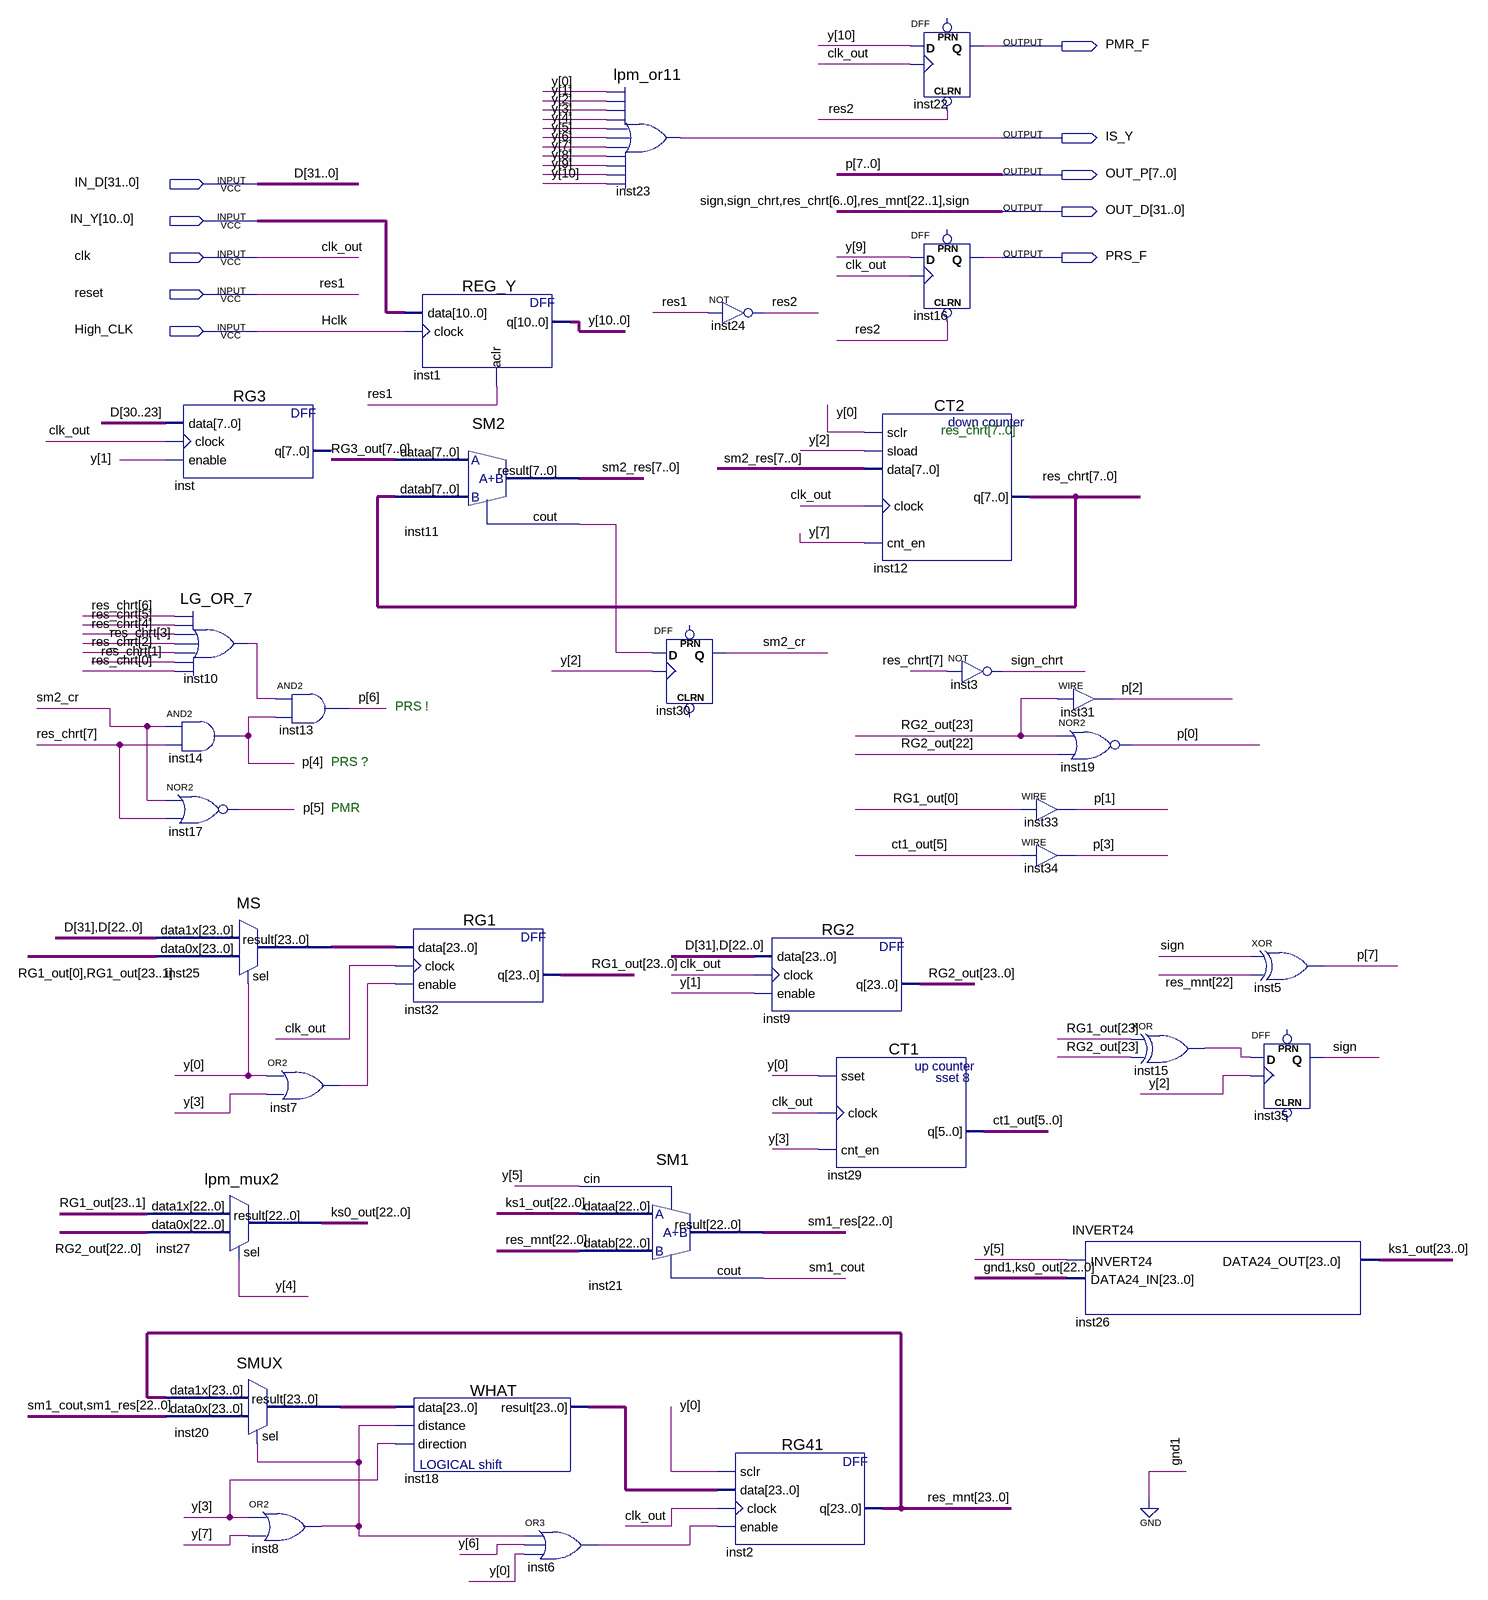
[diagram p0: schematic sheet]
// Quartus schematic Mult_DK_1.bdf as structural Verilog: 34 symbols, 10 pins
module Mult_DK_1 (
  input  [31:0] IN_D,
  input  [10:0] IN_Y,
  input  clk,
  input  reset,
  input  High_CLK,
  output PMR_F,
  output IS_Y,
  output [7:0] OUT_P,
  output [31:0] OUT_D,
  output PRS_F
);

  wire inst6_out, inst7_out, inst8_out, inst10_result, inst11_cout, inst15_out, res2, sm1_cout, sm2_cr;
  wire [5:0] ct1_out;
  wire [7:0] RG3_out, sm2_res;
  wire [7:7] res_chrt;
  wire [10:0] y;
  wire [22:0] ks0_out, sm1_res;
  wire [23:0] inst18_result, inst20_result, inst25_result, ks1_out, res_mnt, RG1_out, RG2_out;

  RG3 inst (.data(IN_D[30:23]), .clock(clk), .enable(y[1]));  // open: q
  LG_OR_7 inst10 (
    .data0(OUT_D[29]), .data1(OUT_D[28]), .data2(OUT_D[27]), .data3(OUT_D[26]), .data4(OUT_D[25]),
    .data5(OUT_D[24]), .data6(OUT_D[23]), .result(inst10_result));
  and inst14 (OUT_P[4], sm2_cr, res_chrt[7]);
  nor inst17 (OUT_P[5], sm2_cr, res_chrt[7]);
  MS inst25 (.data1x({IN_D[31], IN_D[22:0]}), .data0x({RG1_out[0], RG1_out[23:1]}), .sel(y[0]), .result(inst25_result));
  lpm_mux2 inst27 (.data1x(RG1_out[23:1]), .data0x(RG2_out[22:0]), .sel(y[4]), .result(ks0_out));
  SMUX inst20 (
    .data1x({res_mnt[23], OUT_D[22:1], res_mnt[0]}), .data0x({sm1_cout, sm1_res}), .sel(inst8_out),
    .result(inst20_result));
  or inst7 (inst7_out, y[0], y[3]);
  or inst8 (inst8_out, y[3], y[7]);
  and inst13 (OUT_P[6], inst10_result, OUT_P[4]);
  REG_Y inst1 (.data(IN_Y), .clock(High_CLK), .aclr(reset), .q(y));
  SM2 inst11 (.dataa(RG3_out), .datab({res_chrt[7], OUT_D[29:23]}), .result(sm2_res), .cout(inst11_cout));
  RG1 inst32 (.data(inst25_result), .clock(clk), .enable(inst7_out), .q(RG1_out));
  WHAT inst18 (.data(inst20_result), .distance(inst8_out), .direction(y[3]), .result(inst18_result));
  or inst6 (inst6_out, inst8_out, y[6], y[0]);
  lpm_or11 inst23 (
    .data0(y[0]), .data1(y[1]), .data2(y[2]), .data3(y[3]), .data4(y[4]), .data5(y[5]), .data6(y[6]),
    .data7(y[7]), .data8(y[8]), .data9(y[9]), .data10(y[10]), .result(IS_Y));
  SM1 inst21 (.dataa(ks1_out[22:0]), .datab({OUT_D[22:1], res_mnt[0]}), .cin(y[5]), .result(sm1_res), .cout(sm1_cout));
  not inst24 (res2, reset);
  DFF inst30 (.CLK(y[2]), .D(inst11_cout), .Q(sm2_cr));  // open: CLRN, PRN
  RG2 inst9 (.data({IN_D[31], IN_D[22:0]}), .clock(clk), .enable(y[1]), .q(RG2_out));
  RG41 inst2 (
    .sclr(y[0]), .data(inst18_result), .clock(clk), .enable(inst6_out),
    .q({res_mnt[23], OUT_D[22:1], res_mnt[0]}));
  CT1 inst29 (.sset(y[0]), .clock(clk), .cnt_en(y[3]), .q(ct1_out));
  DFF inst22 (.CLRN(res2), .CLK(clk), .D(y[10]), .Q(PMR_F));  // open: PRN
  DFF inst16 (.CLRN(res2), .CLK(clk), .D(y[9]), .Q(PRS_F));  // open: PRN
  CT2 inst12 (.sclr(y[0]), .sload(y[2]), .data(sm2_res), .clock(clk), .cnt_en(y[7]), .q({res_chrt[7], OUT_D[29:23]}));
  not inst3 (OUT_D[30], res_chrt[7]);
  assign OUT_P[2] = RG2_out[23];  // WIRE inst31
  nor inst19 (OUT_P[0], RG2_out[23], RG2_out[22]);
  assign OUT_P[1] = RG1_out[0];  // WIRE inst33
  assign OUT_P[3] = ct1_out[5];  // WIRE inst34
  INVERT24 inst26 (.INVERT24(y[5]), .DATA24_IN({1'b0, ks0_out}), .DATA24_OUT(ks1_out));
  xor inst15 (inst15_out, RG1_out[23], RG2_out[23]);
  xor inst5 (OUT_P[7], OUT_D[31], OUT_D[22]);
  DFF inst35 (.CLK(y[2]), .D(inst15_out), .Q(OUT_D[31]));  // open: CLRN, PRN

  assign OUT_D[0] = OUT_D[31];

  // Other names for the same wires on the sheet: clk_out = clk; D[31:0] = IN_D; Hclk = High_CLK; p[7:0] = OUT_P;
  //   res1 = reset; res_chrt[6:0] = OUT_D[29:23]; res_mnt[22:1] = OUT_D[22:1]; sign = OUT_D[31];
  //   sign_chrt = OUT_D[30]

  // Notes on the sheet:
  //   res_chrt[7..0]
  //   PRS !
  //   PRS ?
  //   PMR
endmodule
